# EAGLE design CPS_Breakout (EAGLE 9.5.2)
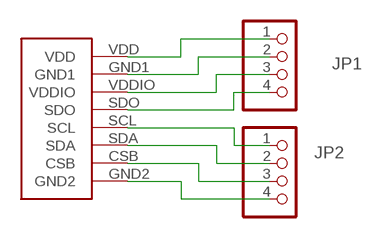
[diagram p0: schematic, sheet 1]

## Parts
B1  CPS123  [CPS123]
JP1  PINHD-1X4  [1X04]
JP2  PINHD-1X4  [1X04]

## Nets
N$1: B1.GND1 JP1.2
N$2: B1.VDD JP1.1
N$3: B1.VDDIO JP1.3
N$4: B1.SDO JP1.4
N$5: B1.SCL JP2.1
N$6: B1.SDA JP2.2
N$7: B1.CSB JP2.3
N$8: B1.GND2 JP2.4

## Library data of the parts
B1 = CPS123:CPS123: MEMS Barometer from Consensic
JP1 JP2 = pinhead:PINHD-1X4: PIN HEADER

## Board
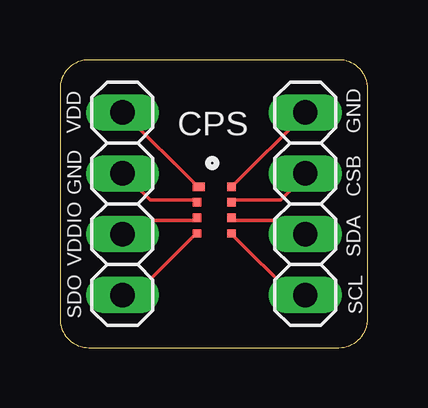
[diagram p1: board, top side]

Size 12.82 x 12 mm. Coordinates in mm from the lower left corner, seen from the top.
Outline: 0,10.8 0,1.2 arc90 1.2,0 11.62,0 arc90 12.82,1.2 12.82,10.8 arc90 11.62,12 1.2,12 arc90 0,10.8
Copper layers (1*16): Top 0.035mm / dielectric 1.5mm / Bottom 0.035mm
Design rules "default": minimum track width 6mil, minimum drill 0.35mm, track to track 6mil, track to pad 6mil, pad to pad 6mil, via to via 6mil, smd to smd 6mil, copper to edge 40mil, drill to drill 6mil, minimum pad ring 10mil, minimum via ring 8mil, stop-mask expansion 4mil, vias tented up to drill 0mil, thermal gap 10mil

### Footprints (pad centres in the part's own frame; a part is rotated, then mirrored left to right if it is on the bottom)
CPS123 = smd 0.35 x 0.35: CSB 1.3,0; GND1 1.3,1.45; GND2 1.95,0; SCL 0,0; SDA 0.65,0; SDO 0,1.45; VDDIO 0.65,1.45 | smd 0.35 x 0.5: VDD 1.95,1.375
1X04 = drill 1.016 long: 1 -3.81,0; 2 -1.27,0; 3 1.27,0; 4 3.81,0

### Placement (x,y rotation side)
B1  7.15,4.76 90 top
JP1  2.6,6 270 top
JP2  10.22,6 90 top

### Tracks (layer width: path | path; a pad name or v marks a point on that pad's centre or on a via)
N$1
  Top 0.152: B1.GND1 5.55,6.15 3.76,6.15 2.74,7.16 JP1.2
N$2
  Top 0.152: B1.VDD 5.74,6.71 2.66,9.79 JP1.1
N$3
  Top 0.152: B1.VDDIO 5.6,5.31 3.17,5.31 2.74,4.88 JP1.3
N$4
  Top 0.152: B1.SDO 5.64,4.72 3.1,2.19 JP1.4
N$5
  Top 0.152: JP2.1 9.7,2.19 7.16,4.72 B1.SCL
N$6
  Top 0.152: JP2.2 10.21,4.88 9.78,5.31 7.17,5.31 7.17,5.4 B1.SDA
N$7
  Top 0.152: B1.CSB 7.18,6.15 9.2,6.15 10.21,7.16 JP2.3
N$8
  Top 0.152: B1.GND2 7.17,6.71 10.22,9.76 JP2.4

### Text on the board
tNames: VDD | CPS | GND | GND | CSB | SDA | VDDIO | SDO | SCL